# Altium schematic sheet pca20035_sheet6_interface.SchDoc: Thingy:91 Interface
size A3; Organization: Nordic Semiconductor; DocumentNumber: 6; SheetNumber: 6; SheetTotal: 6; CompanyName: Nordic Semiconductor; DocumentSize: A3
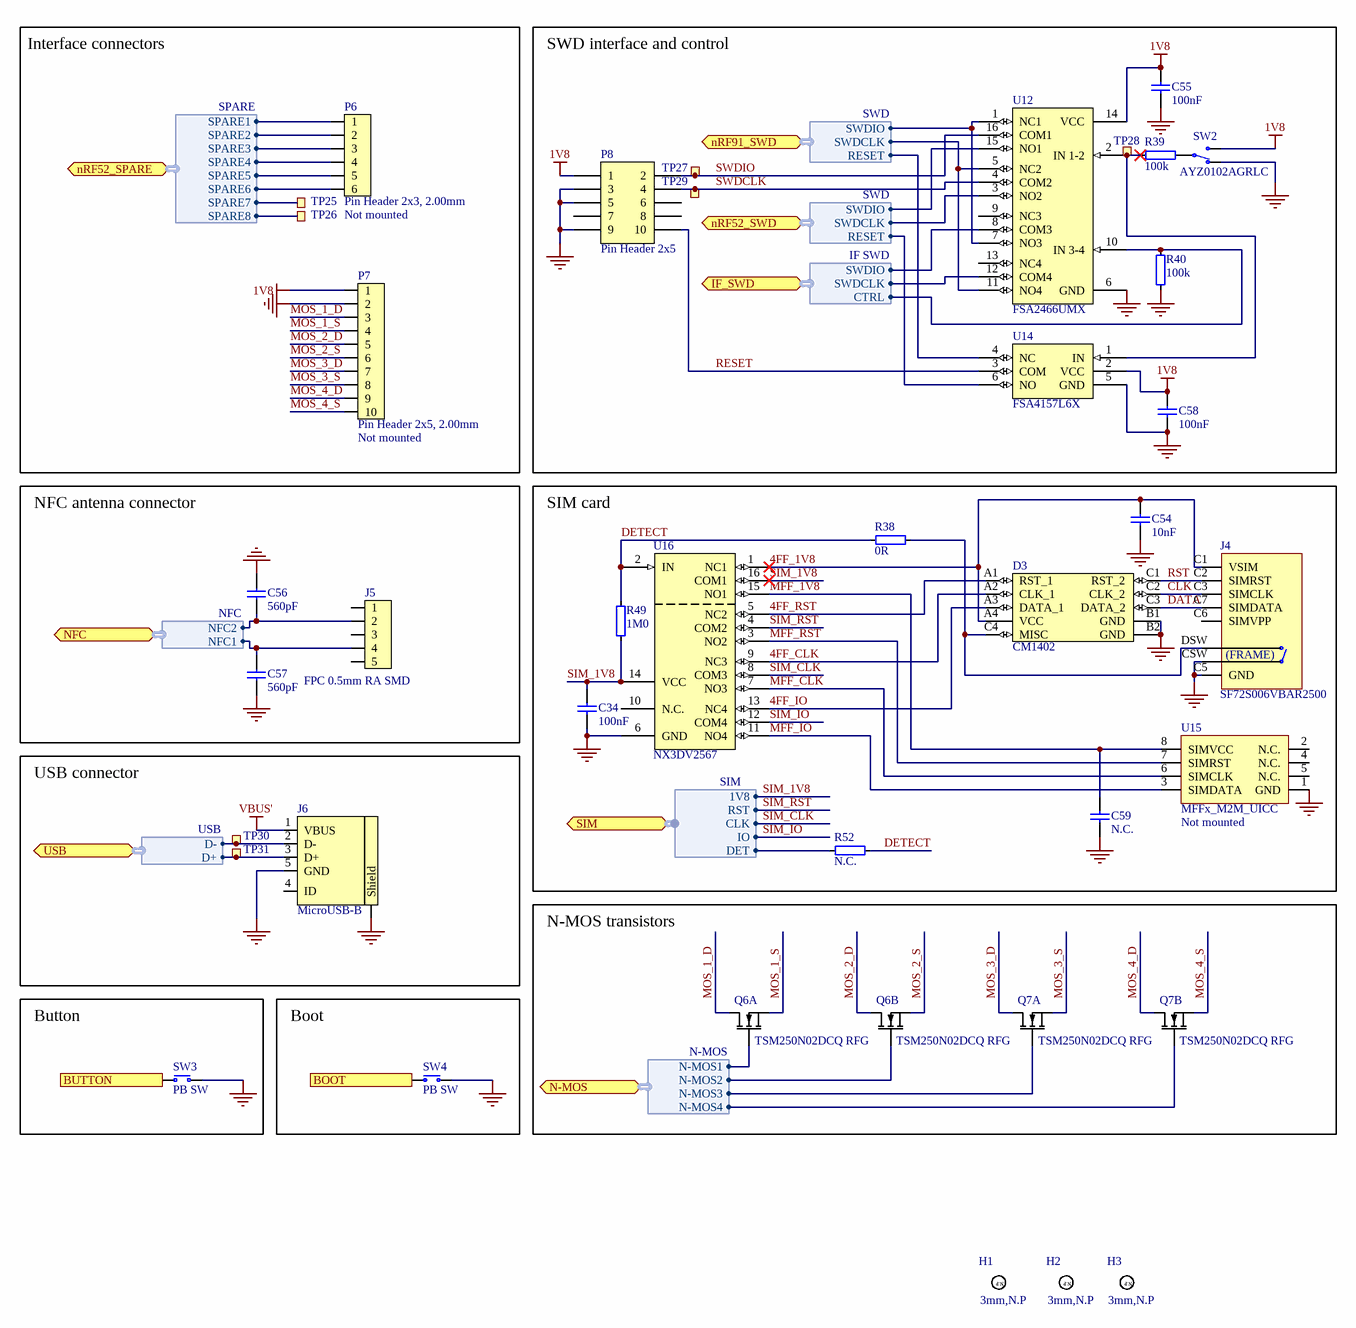
[diagram p0: pca20035_sheet6_interface.SchDoc]

## Parts
C34  100nF  [CAPC0603X03L_C]
C54  10nF  [CAPC0603X03L_C]
C55  100nF  [CAPC0603X03L_C]
C56  560pF  [CAPC0603X03L_C]
C57  560pF  [CAPC0603X03L_C]
C58  100nF  [CAPC0603X03L_C]
C59  N.C.  [CAPC0603X03L_C_NC]
D3  CM1402  [CM1402]
H1  3mm,N.P  [HOLE_NP_3MM]  (no BOM)
H2  3mm,N.P  [HOLE_NP_3MM]  (no BOM)
H3  3mm,N.P  [HOLE_NP_3MM]  (no BOM)
J4  SF72S006VBAR2500  [SF72S006VBAR2500]
J5  FPC 0.5mm RA SMD  [FPC_05P-0.5mm-RA-SMD]
J6  MicroUSB-B  [USB-Micro-B-RA-SMD-PiP]
P6  Pin Header 2x3, 2.00mm  Assembly: Not mounted  [HDR_2x3_TH_2.00MM-NC]
P7  Pin Header 2x5, 2.00mm  Assembly: Not mounted  [HDR_2x5_TH_2.00MM-NC]
P8  Pin Header 2x5  [HDR_2x5-SMD-1.27mm-ANG]
Q6  TSM250N02DCQ RFG  [DFN65P200X200X80_HS-6N]  (parts A,B of 2)
Q7  TSM250N02DCQ RFG  [DFN65P200X200X80_HS-6N]  (parts A,B of 2)
R38  0R  [RESC0603X03L_C]
R39  100k  [RESC0603X03L_C]
R40  100k  [RESC0603X03L_C]
R49  1M0  [RESC0603X03L_C]
R52  N.C.  [RESC0603X03L_C_NC]
SW2  AYZ0102AGRLC  [AYZ0102AGRLC]
SW3  PB SW  [Switch-PB-6.2x6.3mm-SMD]
SW4  PB SW  [SW_TACTILE_2.6x3.0MM_4-LEAD]
TP25  Ø1.0mm,SMD  [TP_SMD_Ø1.0mm]  (value not drawn)  (no BOM)
TP26  Ø1.0mm,SMD  [TP_SMD_Ø1.0mm]  (value not drawn)  (no BOM)
TP27  Ø1.5mm,SMD  [TP_SMD_Ø1.5mm]  (value not drawn)  (no BOM)
TP28  Ø1.5mm,SMD  [TP_SMD_Ø1.5mm]  (value not drawn)  (no BOM)
TP29  Ø1.5mm,SMD  [TP_SMD_Ø1.5mm]  (value not drawn)  (no BOM)
TP30  Ø1.5mm,SMD  [TP_SMD_Ø1.5mm]  (value not drawn)  (no BOM)
TP31  Ø1.5mm,SMD  [TP_SMD_Ø1.5mm]  (value not drawn)  (no BOM)
U12  FSA2466UMX  [XQFN40P180X260X50-16N]
U14  FSA4157L6X  [PSON50P100X60-6N]
U15  MFFx_M2M_UICC  Assembly: Not mounted  [SON127P600X90_HS-8N]
U16  NX3DV2567  [XQFN40P180X260X50-16N]

## Blocks framed on the sheet
Interface connectors: P6 P7 TP25 TP26
SWD interface and control: C55 C58 P8 R39 R40 SW2 TP27-TP29 U12 U14
NFC antenna connector: C56 C57 J5
SIM card: C34 C54 C59 D3 J4 R38 R49 R52 U15 U16
USB connector: J6 TP30 TP31
N-MOS transistors: Q6 Q7
Button: SW3
Boot: SW4

## Ports
BOOT (out), BUTTON (out), IF_SWD (bidir, harness IF SWD), N-MOS (bidir, harness N-MOS), NFC (bidir, harness NFC), nRF52_SPARE (bidir, harness SPARE), nRF52_SWD (bidir, harness SWD), nRF91_SWD (bidir, harness SWD), SIM (bidir, harness SIM), USB (bidir, harness USB)

## Harnesses
SWD: SWDIO, SWDCLK, RESET
IF SWD: SWDIO, SWDCLK, CTRL
NFC: NFC2, NFC1
N-MOS: N-MOS1, N-MOS2, N-MOS3, N-MOS4
SPARE: SPARE1, SPARE2, SPARE3, SPARE4, SPARE5, SPARE6, SPARE7, SPARE8
USB: D-, D+
SIM: DET, RST, CLK, IO, 1V8

## Nets
1V8: C55.1 C58.1 P7.1 P8.1 SW2.3(N.O) U12.14(VCC) U14.2(VCC)
GND: C34.1 C54.2 C55.2 C56.2 C57.1 C58.2 C59.1 D3.B1(GND) D3.B2(GND) J4.0(GND) J4.C5(GND) J4.CSW J6.5(GND) J6.6(Shield) P7.2 P8.3 P8.5 P8.9 R40.2 SW2.1(N.C) SW3.1(N.O) SW4.1(N.O) U12.6(GND) U14.5(GND) U15.1(GND) U16.6(GND)
VBUS': J6.1(VBUS)
4FF_1V8: C54.1 D3.A4(VCC) J4.C1(VSIM) U16.1(NC1)
4FF_CLK: D3.A2(CLK_1) U16.9(NC3)
4FF_IO: D3.A3(DATA_1) U16.13(NC4)
4FF_RST: D3.A1(RST_1) U16.5(NC2)
BOOT: SW4.2(COM) ; port BOOT
BUTTON: SW3.2(COM) ; port BUTTON
CLK: D3.C2(CLK_2) J4.C3(SIMCLK)
DATA: D3.C3(DATA_2) J4.C7(SIMDATA)
DETECT: R38.2 R49.1 R52.1 U16.2(IN)
MFF_1V8: C59.2 U15.8(SIMVCC) U16.15(NO1)
MFF_CLK: U15.6(SIMCLK) U16.7(NO3)
MFF_IO: U15.3(SIMDATA) U16.11(NO4)
MFF_RST: U15.7(SIMRST) U16.3(NO2)
MOS_1_D: P7.3 Q6.6(D1)
MOS_1_S: P7.4 Q6.1(S1)
MOS_2_D: P7.5 Q6.3(D2)
MOS_2_S: P7.6 Q6.4(S2)
MOS_3_D: P7.7 Q7.6(D1)
MOS_3_S: P7.8 Q7.1(S1)
MOS_4_D: P7.9 Q7.3(D2)
MOS_4_S: P7.10 Q7.4(S2)
RESET: P8.10 U14.3(COM)
RST: D3.C1(RST_2) J4.C2(SIMRST)
SIM_1V8: C34.2 R49.2 U16.14(VCC) U16.16(COM1) ; port SIM.1V8
SIM_CLK: U16.8(COM3) ; port SIM.CLK
SIM_IO: U16.12(COM4) ; port SIM.IO
SIM_RST: U16.4(COM2) ; port SIM.RST
SWDCLK: P8.4 TP29.1 U12.4(COM2)
SWDIO: P8.2 TP27.1 U12.16(COM1)
NetC56_1: C56.1 J5.2 ; port NFC.NFC2
NetC57_2: C57.2 J5.4 ; port NFC.NFC1
NetD3_C4: D3.C4(MISC) J4.DSW R38.1
NetJ6_2: J6.2(D-) TP30.1 ; port USB.D-
NetJ6_3: J6.3(D+) TP31.1 ; port USB.D+
NetP6_1: P6.1 ; port nRF52_SPARE.SPARE1
NetP6_2: P6.2 ; port nRF52_SPARE.SPARE2
NetP6_3: P6.3 ; port nRF52_SPARE.SPARE3
NetP6_4: P6.4 ; port nRF52_SPARE.SPARE4
NetP6_5: P6.5 ; port nRF52_SPARE.SPARE5
NetP6_6: P6.6 ; port nRF52_SPARE.SPARE6
NetQ6_2: Q6.2(G1) ; port N-MOS.N-MOS1
NetQ6_5: Q6.5(G2) ; port N-MOS.N-MOS2
NetQ7_2: Q7.2(G1) ; port N-MOS.N-MOS3
NetQ7_5: Q7.5(G2) ; port N-MOS.N-MOS4
NetR39_1: R39.1 SW2.2(COM)
NetR39_2: R39.2 TP28.1 U12.2(IN_1-2) U14.1(IN)
NetR40_1: R40.1 U12.10(IN_3-4) ; port IF_SWD.CTRL
NetR52_2: R52.2 ; port SIM.DET
NetTP25_1: TP25.1 ; port nRF52_SPARE.SPARE7
NetTP26_1: TP26.1 ; port nRF52_SPARE.SPARE8
NetU12_1: U12.1(NC1) U12.7(NO3) ; port nRF91_SWD.SWDIO
NetU12_3: U12.3(NO2) ; port nRF52_SWD.SWDCLK
NetU12_5: U12.5(NC2) U12.11(NO4) ; port nRF91_SWD.SWDCLK
NetU12_8: U12.8(COM3) ; port IF_SWD.SWDIO
NetU12_12: U12.12(COM4) ; port IF_SWD.SWDCLK
NetU12_15: U12.15(NO1) ; port nRF52_SWD.SWDIO
NetU14_4: U14.4(NC) ; port nRF91_SWD.RESET
NetU14_6: U14.6(NO) ; port nRF52_SWD.RESET

Not connected (* = marked no-connect by the designer): H1 1; H2 1; H3 1; J4 C6(SIMVPP); J5 1 3 5; J6 4(ID); P8 6 7 8; U12 9(NC3) 13(NC4); U15 2(N.C.) 4(N.C.) 5(N.C.); U16 10(N.C.)

## Notes on the sheet
- Size
- Date:
- A3
- Project Number
- Sheet         of
- Revision
- File:
- Drawn By:
- (in symbol Hole_3MM_NP) N.P
- (in symbol SF72S006VBAR2500) (FRAME)

## Library data of the parts
C34 C55 C58 = C0201-100n: Capacitor, X5R, ±10%; Manufacturer: N.A.; Part number IPS: 00000001248, 00000002505; Note: 16V; Pad Count: 2; Part Number: C0201-100n; Manufacturer Part Number: N.A.; ComponentLink1URL: N.A.; ComponentLink1Description: Datasheet; ComponentLink2URL: N.A.; ComponentLink2Description: Supplier link; HelpURL: N.A.; Footprint Doc: 0201; LatestRevisionDate: 2017-11-09; Published: 2014-11-13; Value: 100nF; Artikkelnr Noca: N.A.; Supplier 1: N.A.; Supplier Part Number 1: N.A.; Supplier 2: N.A.; Supplier Part Number 2: N.A.; Component Class: Capacitors; PartId: 100200078
C54 = C0201-10n: Capacitor, X7R, ±10%; Manufacturer: N.A.; Part number IPS: 00000003480; Note: 10V; Pad Count: 2; Part Number: C0201-10n; Manufacturer Part Number: N.A.; Footprint Doc: 0201; LatestRevisionDate: 2017-11-09; Published: 2014-11-13; Value: 10nF; Artikkelnr Noca: N.A.; ComponentLink1URL: N.A.; ComponentLink1Description: Datasheet; ComponentLink2URL: N.A.; ComponentLink2Description: Supplier link; HelpURL: N.A.; Supplier 1: N.A.; Supplier Part Number 1: N.A.; Supplier 2: N.A.; Supplier Part Number 2: N.A.; Component Class: Capacitors; PartId: 100200067
C56 C57 = C0201-560p: Capacitor, NP0, ±5%, 25V; Manufacturer: N.A.; Part number IPS: 00000001808; Pad Count: 2; Part Number: C0201-560p; Manufacturer Part Number: N.A.; Footprint Doc: 0201; LatestRevisionDate: 2020-12-16; Published: 2014-11-13; Value: 560pF; Note: 25V; Artikkelnr Noca: N.A.; ComponentLink1URL: N.A.; ComponentLink1Description: Datasheet; ComponentLink2URL: N.A.; ComponentLink2Description: Supplier link; HelpURL: N.A.; Supplier 1: N.A.; Supplier Part Number 1: N.A.; Supplier 2: N.A.; Supplier Part Number 2: N.A.; Component Class: Capacitors; PartId: 100200053
C59 = C0201-N.C.: Not mounted; Manufacturer: N.A.; Note: Chip Cap; Assembly: Not mounted; Pad Count: 2; Part Number: C0201-N.C.; Manufacturer Part Number: N.A.; ComponentLink1URL: N.A.; ComponentLink1Description: Datasheet; ComponentLink2URL: N.A.; ComponentLink2Description: Supplier link; HelpURL: N.A.; Footprint Doc: 0201; LatestRevisionDate: 2014-11-13; Published: 2014-11-13; Value: N.C.; Artikkelnr Noca: N.A.; Part number IPS: N.A.; Supplier 1: N.A.; Supplier Part Number 1: N.A.; Supplier 2: N.A.; Supplier Part Number 2: N.A.; Component Class: Capacitors; PartId: 100200001
D3 = CM1402: EMI Network Filter Arrays SIM CARD EMI FILTER WITH ESD PROTECTION; Manufacturer: ON Semiconductor; Manufacturer Part Number: CM1402-03CP; Part number IPS: 00000009949; Note: N.A.; Pad Count: 10; Part Number: CM1402; Footprint Doc: CM1402; LatestRevisionDate: 2017-02-06; Published: 2017-02-06; Value: CM1402; Artikkelnr Noca: N.A.; ComponentLink1URL: N.A.; ComponentLink1Description: Datasheet; ComponentLink2URL: N.A.; ComponentLink2Description: Supplier link; HelpURL: http://www.onsemi.com/pub_link/Collateral/CM1402-D.PDF; Supplier 1: Digi-Key; Supplier Part Number 1: CM1402-03CPOSTR-ND; Supplier 2: Mouser; Supplier Part Number 2: 748-CM1402-03CP; Component Class: Semiconductors; PartId: 101300139
H1-H3 = Hole_3MM_NP: Regular Non-Plated, 3mm hole; Manufacturer: Nordic Semiconductor; Manufacturer Part Number: N.A.; Pad Count: 1; Part Number: Hole_3MM_NP; Footprint Doc: Hole_3MM_NP; LatestRevisionDate: 2009-12-12; Published: 2009-12-12; Value: 3mm,N.P; Note: Regular Non-Plated, 3mm hole; Artikkelnr Noca: N.A.; Part number IPS: N.A.; ComponentLink1URL: N.A.; ComponentLink1Description: Datasheet; ComponentLink2URL: N.A.; ComponentLink2Description: Supplier link; HelpURL: N.A.; Supplier 1: N.A.; Supplier Part Number 1: N.A.; Supplier 2: N.A.; Supplier Part Number 2: N.A.; Component Class: Connectors; PartId: 100500145
J4 = SF72S006VBAR2500: n 8 (6 + 2) Position Card Connector NANO SIM Surface Mount, Right Angle Gold; Manufacturer: JAE Electronics; Part number IPS: 00000009956; Note: N.A.; Pad Count: 8; Part Number: SF72S006VBAR2500; Manufacturer Part Number: SF72S006VBAR2500; Footprint Doc: SF72S006VBAR2500; LatestRevisionDate: 2016-09-09; Published: 2016-09-09; Value: SF72S006VBAR2500; Artikkelnr Noca: N.A.; ComponentLink1URL: N.A.; ComponentLink1Description: Datasheet; ComponentLink2URL: N.A.; ComponentLink2Description: Supplier link; HelpURL: http://jae-connectors.com/en/pdf/MB-0282-1E_SF72.pdf; Supplier 1: Digi-Key; Supplier Part Number 1: 670-2799-1-ND; Supplier 2: Mouser; Supplier Part Number 2: 656-SF72S006VBAR2500; Component Class: Connectors; PartId: 100500572
J5 = FPC_05P-0.5mm-RA-SMD: 0.5mm FPC, 5P,Right Angle SMT,Double Contact,H=1.2mm,White, Tin plated; Manufacturer: W-CON; Manufacturer Part Number: 5141-05RZDNWR01; Part number IPS: 00000007792; Note: N.A.; Artikkelnr Noca: 55010020; Pad Count: 7; Part Number: FPC_05P-0.5mm-RA-SMD; Footprint Doc: FPC_05P-0.5mm-RA-SMD; LatestRevisionDate: 2016-04-21; Published: 2015-06-22; Value: FPC 0.5mm RA SMD; ComponentLink1URL: N.A.; ComponentLink1Description: Datasheet; ComponentLink2URL: N.A.; ComponentLink2Description: Supplier link; HelpURL: \\hizz\pro\app9717\Datasheet\connectors\W-CON\5141-XXRZDNXX0X.pdf; Supplier 1: Cabcon; Supplier Part Number 1: 5141-05RZDNWR01; Supplier 2: Digi-Key; Supplier Part Number 2: WM9836CT-ND; Component Class: Connectors; PartId: 100500528
J6 = USB-Micro-B-RA-SMD-PiP: MicroUSB-B-SMT; Manufacturer: Allen Creations Corp.; Manufacturer Part Number: AJU55-BS2111-L; Part number IPS: 00000007790; Note: N.A.; Artikkelnr Noca: 55029020; Pad Count: 5; Part Number: USB-Micro-B-RA-SMD-PiP; Footprint Doc: USB-Micro-B-RA-SMD-PiP; LatestRevisionDate: 2016-04-21; Published: 2014-10-07; Value: MicroUSB-B; ComponentLink1URL: N.A.; ComponentLink1Description: Datasheet; ComponentLink2URL: N.A.; ComponentLink2Description: Supplier link; HelpURL: \\hizz\pro\app9717\Datasheet\connectors\Allen Creations Corp\AJU-211.pdf; Supplier 1: Cabcon; Supplier Part Number 1: AJU55-BS2111-L; Supplier 2: Digi-Key; Supplier Part Number 2: 609-4616-1-ND; Component Class: Connectors; PartId: 100500490
P6 = Pin Header 2x3 TH, 2.00mm, N.C.: Pin Header 2x3, TH, 2.00mm; Manufacturer: N.A.; Pad Count: 6; Part Number: Pin Header 2x3 TH, 2.00mm, N.C.; Manufacturer Part Number: N.A.; ComponentLink1URL: N.A.; ComponentLink1Description: Datasheet; ComponentLink2URL: N.A.; ComponentLink2Description: Supplier link; HelpURL: N.A.; Footprint Doc: HDR_2x3_TH_2.00MM-NC; LatestRevisionDate: 2019-01-21; Published: 2019-01-21; Value: Pin Header 2x3, 2.00mm; Note: N.A.; Supplier 1: N.A.; Supplier Part Number 1: N.A.; Supplier 2: N.A.; Supplier Part Number 2: N.A.; Artikkelnr Noca: N.A.; Part number IPS: N.A.; Component Class: Connectors; PartId: 100500247
P7 = Pin Header 2x5 TH, 2.00mm, N.C.: Pin Header 2x5, TH, 2.00mm; Manufacturer: N.A.; Pad Count: 6; Part Number: Pin Header 2x5 TH, 2.00mm, N.C.; Manufacturer Part Number: N.A.; ComponentLink1URL: N.A.; ComponentLink1Description: Datasheet; ComponentLink2URL: N.A.; ComponentLink2Description: Supplier link; HelpURL: N.A.; Footprint Doc: HDR_2x5_TH_2.00MM-NC; LatestRevisionDate: 2019-01-21; Published: 2019-01-21; Value: Pin Header 2x5, 2.00mm; Note: N.A.; Supplier 1: N.A.; Supplier Part Number 1: N.A.; Supplier 2: N.A.; Supplier Part Number 2: N.A.; Artikkelnr Noca: N.A.; Part number IPS: N.A.; Component Class: Connectors; PartId: 100500264
P8 = Pin Header 2x5 SMD, 1.27mm, Angled: Pin Header 2x5, 1.27mm (50mil); Manufacturer: W-CON; Manufacturer Part Number: 1325B-1205S0Z080CR02; Part number IPS: 00000007800; Note: N.A.; Pad Count: 10; Part Number: Pin Header 2x5 SMD, 1.27mm, Angled; LatestRevisionDate: 2019-11-20; Published: 2014-01-22; Value: Pin Header 2x5; Artikkelnr Noca: N.A.; Footprint Doc: HDR_2x5-SMD-1.27mm-ANG; ComponentLink1URL: N.A.; ComponentLink1Description: Datasheet; ComponentLink2URL: N.A.; ComponentLink2Description: Supplier link; HelpURL: \\hizz\pro\app9717\Datasheet\connectors\W-CON\1325B-12XXXXZXXXCXXX.pdf; Supplier 1: Cabcon; Supplier Part Number 1: 1325B-1205S0Z080CR02; Supplier 2: Samtec; Supplier Part Number 2: FTSH-105-01-L-DH-A-C-TR; Component Class: Connectors; PartId: 100500257
Q6 Q7 = TSM250N02DCQ RFG: Dual N Ch MOFET, 5.8A, 55mOhm max, 620mW; Manufacturer: Taiwan Semiconductor; Part number IPS: 00000001703; Note: N.A.; Pad Count: 6; Part Number: TSM250N02DCQ RFG; Manufacturer Part Number: TSM250N02DCQ RFG; Footprint Doc: VDFN-6; LatestRevisionDate: 2018-10-31; Published: 2018-10-31; Value: TSM250N02DCQ RFG; Artikkelnr Noca: N.A.; ComponentLink1URL: https://www.taiwansemi.com/products/datasheet/TSM250N02D_B15.pdf; ComponentLink1Description: Datasheet; ComponentLink2URL: N.A.; ComponentLink2Description: Supplier link; HelpURL: https://www.taiwansemi.com/products/datasheet/TSM250N02D_B15.pdf; Supplier 1: Digi-Key; Supplier Part Number 1: TSM250N02DCQRFGCT-ND; Supplier 2: N.A.; Supplier Part Number 2: N.A.; Component Class: Semiconductors; PartId: 101300161
R38 = R0201-0R: Resistor, ±5%, 0.05W; Manufacturer: N.A.; Part number IPS: 00000003245; Note: Chip Res 5%; Pad Count: 2; Part Number: R0201-0R; Manufacturer Part Number: N.A.; Footprint Doc: 0201; LatestRevisionDate: 2017-11-09; Published: 2014-11-13; Value: 0R; Artikkelnr Noca: N.A.; ComponentLink1URL: N.A.; ComponentLink1Description: Datasheet; ComponentLink2URL: N.A.; ComponentLink2Description: Supplier link; HelpURL: N.A.; Supplier 1: N.A.; Supplier Part Number 1: N.A.; Supplier 2: N.A.; Supplier Part Number 2: N.A.; Component Class: Resistors; PartId: 100100001
R39 R40 = R0201-100k: Resistor, ±1%, 0.05W; Manufacturer: N.A.; Part number IPS: 00000001419; Note: Chip Res 1%; Pad Count: 2; Part Number: R0201-100k; Manufacturer Part Number: N.A.; Footprint Doc: 0201; LatestRevisionDate: 2014-11-13; Published: 2014-11-13; Value: 100k; Artikkelnr Noca: N.A.; ComponentLink1URL: N.A.; ComponentLink1Description: Datasheet; ComponentLink2URL: N.A.; ComponentLink2Description: Supplier link; HelpURL: N.A.; Supplier 1: N.A.; Supplier Part Number 1: N.A.; Supplier 2: N.A.; Supplier Part Number 2: N.A.; Component Class: Resistors; PartId: 100100080
R49 = R0201-1M0: Resistor, ±1%, 0.05W; Manufacturer: N.A.; Part number IPS: 00000001418; Note: Chip Res 1%; Pad Count: 2; Part Number: R0201-1M0; Manufacturer Part Number: N.A.; Footprint Doc: 0201; LatestRevisionDate: 2014-11-13; Published: 2014-11-13; Value: 1M0; Artikkelnr Noca: N.A.; ComponentLink1URL: N.A.; ComponentLink1Description: Datasheet; ComponentLink2URL: N.A.; ComponentLink2Description: Supplier link; HelpURL: N.A.; Supplier 1: N.A.; Supplier Part Number 1: N.A.; Supplier 2: N.A.; Supplier Part Number 2: N.A.; Component Class: Resistors; PartId: 100100093
R52 = R0201-N.C.: Not mounted; Manufacturer: N.A.; Assembly: Not mounted; Note: Chip Res; Pad Count: 2; Part Number: R0201-N.C.; Manufacturer Part Number: N.A.; Footprint Doc: 0201; LatestRevisionDate: 2014-11-13; Published: 2014-11-13; Value: N.C.; Artikkelnr Noca: N.A.; Part number IPS: N.A.; ComponentLink1URL: N.A.; ComponentLink1Description: Datasheet; ComponentLink2URL: N.A.; ComponentLink2Description: Supplier link; HelpURL: N.A.; Supplier 1: N.A.; Supplier Part Number 1: N.A.; Supplier 2: N.A.; Supplier Part Number 2: N.A.; PartId: 100100107; Component Class: Resistors
SW2 = AYZ0102AGRLC: Miniature slide switch, SPDT, Right-Angle, ON-ON, 12V, 100mA; Manufacturer: C&K; Part number IPS: 00000002488; Note: N.A.; Pad Count: 3; Part Number: AYZ0102AGRLC; Manufacturer Part Number: AYZ0102AGRLC; ComponentLink1URL: https://www.ckswitches.com/media/1431/ayz.pdf; ComponentLink1Description: Datasheet; ComponentLink2URL: N.A.; ComponentLink2Description: Supplier link; Footprint Doc: AYZ0102AGRLC; LatestRevisionDate: 2019-05-08; Published: 2019-05-08; Value: AYZ0102AGRLC; Artikkelnr Noca: N.A.; Supplier 1: Digi-Key; Supplier Part Number 1: 401-2012-1-ND; Supplier 2: N.A.; Supplier Part Number 2: N.A.; HelpURL: https://www.ckswitches.com/media/1431/ayz.pdf; Component Class: Switches; PartId: 101500120
SW3 = Switch-PB-6.2x6.3mm-SMD: Tactile Switch, SPNO, SMD, 160gf, 6.2x6.3x2.5mm; Manufacturer: Dailywell; Manufacturer Part Number: TS604VM1-025BR-R; Part number IPS: 00000007812; Note: N.A.; Artikkelnr Noca: 50019106; Pad Count: 4; Part Number: Switch-PB-6.2x6.3mm-SMD; Footprint Doc: Switch-PB-6.2x6.3mm-SMD; LatestRevisionDate: 2016-04-21; Published: 2010-02-01; Value: PB SW; ComponentLink1URL: N.A.; ComponentLink1Description: Datasheet; ComponentLink2URL: N.A.; ComponentLink2Description: Supplier link; HelpURL: \\hizz\pro\app9717\Datasheet\switches\Dailywell\TS604VM1-025BR-R.pdf; Supplier 1: Cabcon; Supplier Part Number 1: TS604VM1-025BR-R; Supplier 2: Mouser; Supplier Part Number 2: 688-SKHUALE010; Component Class: Switches; PartId: 101500001
SW4 = KMT021 NGJ LHS: Nano-Miniature Top Actuated Tact Switch with extended life 3.0x2.6mm; Manufacturer: C&K; Part number IPS: 00000005416; Note: N.A.; Pad Count: 4; Part Number: KMT021 NGJ LHS; Manufacturer Part Number: KMT021 NGJ LHS; ComponentLink1URL: N.A.; ComponentLink1Description: Datasheet; ComponentLink2URL: N.A.; ComponentLink2Description: Supplier link; HelpURL: http://media.digikey.com/pdf/Data%20Sheets/C&K/KMT_0xx_NGJ_LHS_Drawing.pdf; Footprint Doc: SW_TACTILE_2.6x3.0MM_4-LEAD; LatestRevisionDate: 2013-08-12; Published: 2013-08-12; Value: PB SW; Supplier 1: Digi-Key; Supplier Part Number 1: CKN10289CT-ND; Supplier 2: Farnell; Supplier Part Number 2: 190-8260; Artikkelnr Noca: N.A.; Component Class: Switches; PartId: 101500039
TP25 TP26 = TP_SMD_Ø1.0MM: 1.0mm circular SMD testpad; Manufacturer: Nordic Semiconductor; Manufacturer Part Number: N.A.; Pad Count: 1; Part Number: TP_SMD_Ø1.0MM; Footprint Doc: TP_SMD_Ø1.0mm; LatestRevisionDate: 2013-06-11; Published: 2013-06-11; Value: Ø1.0mm,SMD; Note: N.A.; Artikkelnr Noca: N.A.; Part number IPS: N.A.; ComponentLink1URL: N.A.; ComponentLink1Description: Datasheet; ComponentLink2URL: N.A.; ComponentLink2Description: Supplier link; HelpURL: N.A.; Supplier 1: N.A.; Supplier Part Number 1: N.A.; Supplier 2: N.A.; Supplier Part Number 2: N.A.; Component Class: Connectors; PartId: 100500475
TP27-TP31 = TP_SMD_Ø1.5MM: 1.5mm circular SMD testpad; Manufacturer: Nordic Semiconductor; Manufacturer Part Number: N.A.; Pad Count: 1; Part Number: TP_SMD_Ø1.5MM; Footprint Doc: TP_SMD_Ø1.5mm; LatestRevisionDate: 2016-06-02; Published: 2016-06-02; Value: Ø1.5mm,SMD; Note: N.A.; Artikkelnr Noca: N.A.; Part number IPS: N.A.; ComponentLink1URL: N.A.; ComponentLink1Description: Datasheet; ComponentLink2URL: N.A.; ComponentLink2Description: Supplier link; HelpURL: N.A.; Supplier 1: N.A.; Supplier Part Number 1: N.A.; Supplier 2: N.A.; Supplier Part Number 2: N.A.; Component Class: Connectors; PartId: 100500477
U12 = FSA2466UMX: Data / Audio Low-Voltage Dual DPDT Analog Switch; Manufacturer: ON Semiconductor; Part number IPS: 00000009986; Note: N.A.; Artikkelnr Noca: 15070069; Pad Count: 16; Part Number: FSA2466UMX; Manufacturer Part Number: FSA2466UMX; ComponentLink1URL: N.A.; ComponentLink1Description: Datasheet; ComponentLink2URL: N.A.; ComponentLink2Description: Supplier link; HelpURL: https://www.onsemi.com/pub/Collateral/FSA2466-D.PDF; Footprint Doc: UFQFN-16; LatestRevisionDate: 2019-05-15; Published: 2016-05-18; Value: FSA2466UMX; Supplier 1: Digi-Key; Supplier Part Number 1: FSA2466UMXCT-ND; Supplier 2: Mouser; Supplier Part Number 2: 512-FSA2466UMX; Component Class: Misc_ICs; PartId: 101900422
U14 = FSA4157L6X: Low-Voltage, SPDT Analog Switch, 1.65 V to 5.5 V; Manufacturer: ON Semiconductor; Part number IPS: 00000003748; Note: N.A.; Pad Count: 6; Part Number: FSA4157L6X; Manufacturer Part Number: FSA4157L6X; ComponentLink1URL: https://www.onsemi.com/pub/Collateral/FSA4157-D.pdf; ComponentLink1Description: Datasheet; ComponentLink2URL: https://www.digikey.com/product-detail/en/on-semiconductor/FSA4157L6X/FSA4157L6XCT-ND/821004; ComponentLink2Description: Supplier link; HelpURL: https://www.onsemi.com/pub/Collateral/FSA4157-D.pdf; Footprint Doc: UFDFN-6; LatestRevisionDate: 2020-04-29; Published: 2019-10-22; Value: FSA4157L6X; Supplier 1: Digi-Key; Supplier Part Number 1: FSA4157L6XCT-ND; Supplier 2: Mouser; Supplier Part Number 2: 512-FSA4157L6X; Artikkelnr Noca: N.A.; Component Class: Misc_ICs; PartId: 101900593
U15 = M2M_UICC: M2M UICC SIM Card; Manufacturer: N.A.; Pad Count: 8; Part Number: M2M_UICC; Manufacturer Part Number: N.A.; ComponentLink1URL: N.A.; ComponentLink1Description: Datasheet; ComponentLink2URL: N.A.; ComponentLink2Description: Supplier link; HelpURL: N.A.; Footprint Doc: SON-8; LatestRevisionDate: 2019-10-22; Published: 2019-10-22; Value: M2M UICC; Note: N.A.; Supplier 1: N.A.; Supplier Part Number 1: N.A.; Supplier 2: N.A.; Supplier Part Number 2: N.A.; Artikkelnr Noca: N.A.; Part number IPS: N.A.; Component Class: Misc_ICs; PartId: 101900595
U16 = NX3DV2567GU: Low-ohmic four-pole double-throw analog switch; Manufacturer: NXP Semiconductors; Part number IPS: 00000007816; Note: N.A.; Artikkelnr Noca: 15079317; Pad Count: 16; Part Number: NX3DV2567GU; Manufacturer Part Number: NX3DV2567GU; Footprint Doc: XQFN-16; LatestRevisionDate: 2015-02-17; Published: 2015-02-17; Value: NX3DV2567; ComponentLink1URL: N.A.; ComponentLink1Description: Datasheet; ComponentLink2URL: N.A.; ComponentLink2Description: Supplier link; HelpURL: http://www.nxp.com/documents/data_sheet/NX3DV2567.pdf; Supplier 1: Digi-Key; Supplier Part Number 1: 568-5206-1-ND; Supplier 2: Mouser; Supplier Part Number 2: 771-NX3DV2567GU115; Component Class: Misc_ICs; PartId: 101900290